# EAGLE schematic TrialOne (EAGLE 9.2.0)
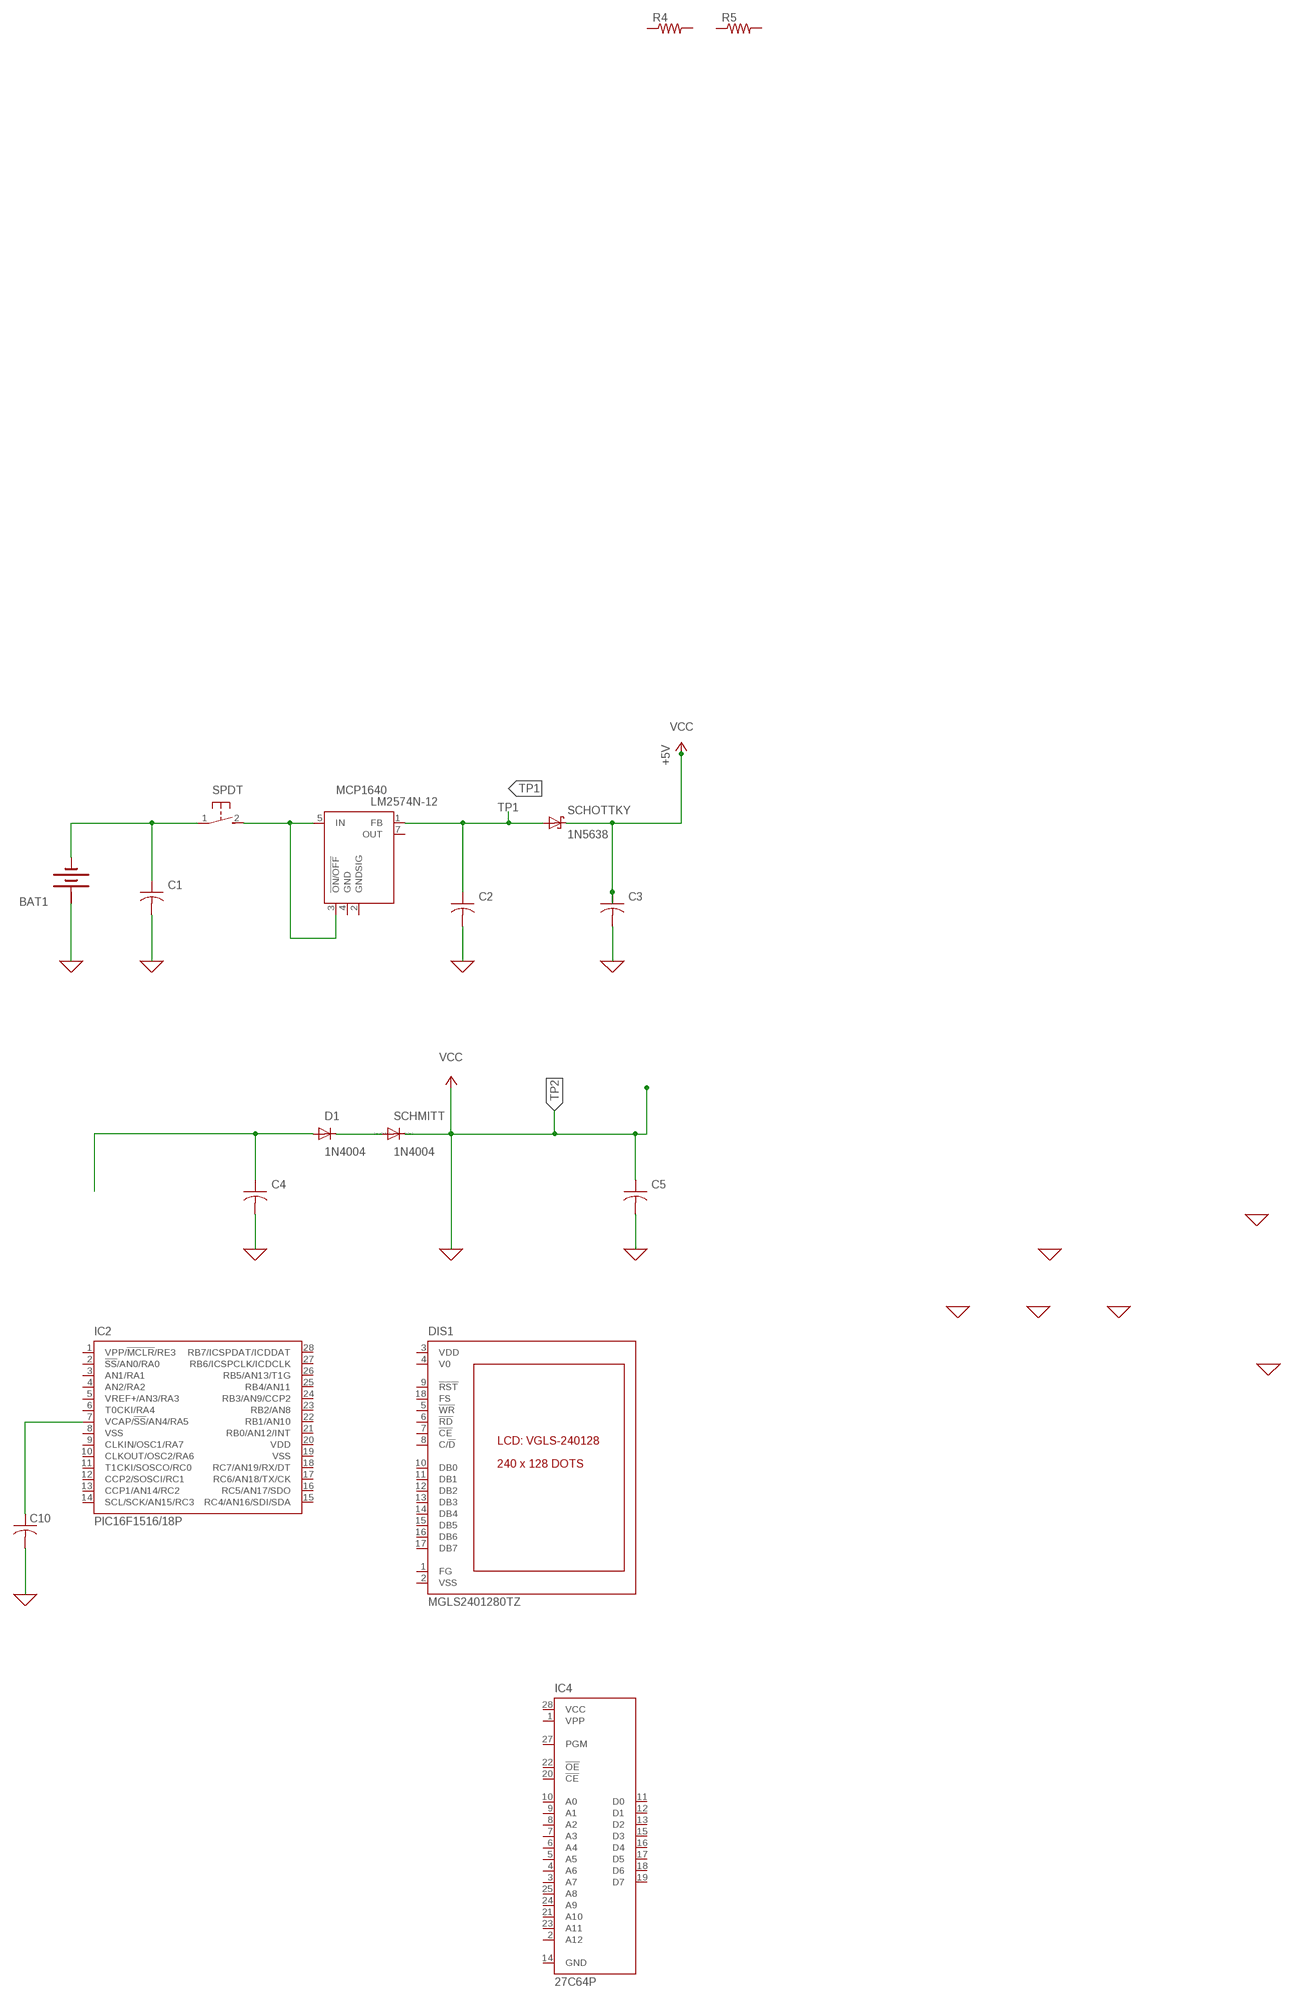
[diagram p0: schematic, sheet 1]

## Parts
BAT1  BATTERY  [BATTERY]
C1  C-US025-024X044  [C025-024X044]
C2  C-US025-024X044  [C025-024X044]
C3  C-US025-024X044  [C025-024X044]
C4  C-US025-024X044  [C025-024X044]
C5  C-US025-024X044  [C025-024X044]
C10  C-US025-024X044  [C025-024X044]
D1  1N4004  [DO41-10]
DIS1  MGLS2401280TZ  [MGLS2401280TZ]
IC2  PIC16F1516/18P  [DIL28-3]
IC4  27C64P  [DIL28-6]
MCP1640  LM2574N-12  [DIL08]
R4  R-US_0204/2V  [0204V]
R5  R-US_0204/2V  [0204V]
SCHMITT  1N4004  [DO41-10]
SCHOTTKY  1N5638  [DO13M]
SPDT  31-XX  [B3F-31XX]

## Nets
0: BAT1.+ C2.2 C4.2 C5.2 ; supply symbol labelled GND
N$1: C10.1 IC2.7(VCAP/!SS!/AN4/RA5)
N$2: BAT1.- C1.1 SPDT.1(P)
N$3: D1.C SCHMITT.A
N$4: C4.1 D1.A
N$5: C1.2 ; supply symbol labelled GND
N$6: MCP1640.3(!ON/OFF) MCP1640.5(IN) SPDT.2(S)
N$7: C3.1 SCHOTTKY.C ; supply symbol labelled +5V, VCC
N$8: C3.2 ; supply symbol labelled GND
N$9: C10.2 ; supply symbol labelled GND
TP1: C2.1 MCP1640.1(FB) SCHOTTKY.A
TP2: C5.1 SCHMITT.C ; supply symbol labelled VCC, GND
Unconnected: DIS1.1(FG) DIS1.2(VSS) DIS1.3(VDD) DIS1.4(V0) DIS1.5(!WR) DIS1.6(!RD) DIS1.7(!CE) DIS1.8(C/!D) DIS1.9(!RST) DIS1.10(DB0) DIS1.11(DB1) DIS1.12(DB2) DIS1.13(DB3) DIS1.14(DB4) DIS1.15(DB5) DIS1.16(DB6) DIS1.17(DB7) DIS1.18(FS) IC2.1(VPP/!MCLR!/RE3) IC2.2(!SS!/AN0/RA0) IC2.3(AN1/RA1) IC2.4(AN2/RA2) IC2.5(VREF+/AN3/RA3) IC2.6(T0CKI/RA4) IC2.9(CLKIN/OSC1/RA7) IC2.10(CLKOUT/OSC2/RA6) IC2.11(T1CKI/SOSCO/RC0) IC2.12(CCP2/SOSCI/RC1) IC2.13(CCP1/AN14/RC2) IC2.14(SCL/SCK/AN15/RC3) IC2.15(RC4/AN16/SDI/SDA) IC2.16(RC5/AN17/SDO) IC2.17(RC6/AN18/TX/CK) IC2.18(RC7/AN19/RX/DT) IC2.21(RB0/AN12/INT) IC2.22(RB1/AN10) IC2.23(RB2/AN8) IC2.24(RB3/AN9/CCP2) IC2.25(RB4/AN11) IC2.26(RB5/AN13/T1G) IC2.27(RB6/ICSPCLK/ICDCLK) IC2.28(RB7/ICSPDAT/ICDDAT) IC4.1(VPP) IC4.2(A12) IC4.3(A7) IC4.4(A6) IC4.5(A5) IC4.6(A4) IC4.7(A3) IC4.8(A2) IC4.9(A1) IC4.10(A0) IC4.11(D0) IC4.12(D1) IC4.13(D2) IC4.15(D3) IC4.16(D4) IC4.17(D5) IC4.18(D6) IC4.19(D7) IC4.20(!CE) IC4.21(A10) IC4.22(!OE) IC4.23(A11) IC4.24(A9) IC4.25(A8) IC4.26(NC) IC4.27(PGM) MCP1640.2(GNDSIG) MCP1640.7(OUT) R4.1 R4.2 R5.1 R5.2

## Power pins joined to a net without a drawn wire
+: BAT1.+@1(+)
GND: IC4.14(GND) MCP1640.4(GND)
VCC: IC4.28(VCC)
VDD: IC2.20(VDD)
VSS: IC2.8(VSS) IC2.19(VSS)

## Library data of the parts
BAT1 = special:BATTERY: BATTERY
C1-C5 C10 = adafruit:C-US: CAPACITOR, American symbol
D1 = adafruit:1N4004: DIODE
DIS1 = display-lcd:MGLS2401280TZ: LCD Display 240 x 128 Dots Source: VARITRONIX LIMITED .. LCD_f1187192714.pdf; OC_FARNELL: 1183196; OC_NEWARK: unknown
IC2 = microchip:PIC16*F1516/18: 28/40/44-Pin Flash Microcontrollers with nanoWatt XLP Technology PIC16F1516/1518 AND PIC16LF1516/1518 Source: www.microchip.com PIC16F1516.pdf
IC4 = microchip:27*64: CMOS EPROM 64 K (8 K x 8), low voltage; MF: Arrow Electronics; MPN: M27C64A-10F1; OC_FARNELL: 1094265; OC_NEWARK: 93K7339
MCP1640 = linear:LM2574?-*: SIMPLE SWITCHER 0.5A Step-Down Voltage Regulator Source: http://cache.national.com/ds/LM/LM2574.pdf
R4 R5 = resistor:R-US_: RESISTOR, American symbol
SCHMITT = diode:1N4004: DIODE
SCHOTTKY = diode:1N5638: DIODE schottky
SPDT = switch-omron:31-XX: OMRON SWITCH; MPN: B3F-3100; OC_FARNELL: 959704; OC_NEWARK: 36M3582